# EAGLE schematic Esquemático 01 (EAGLE 9.6.2)
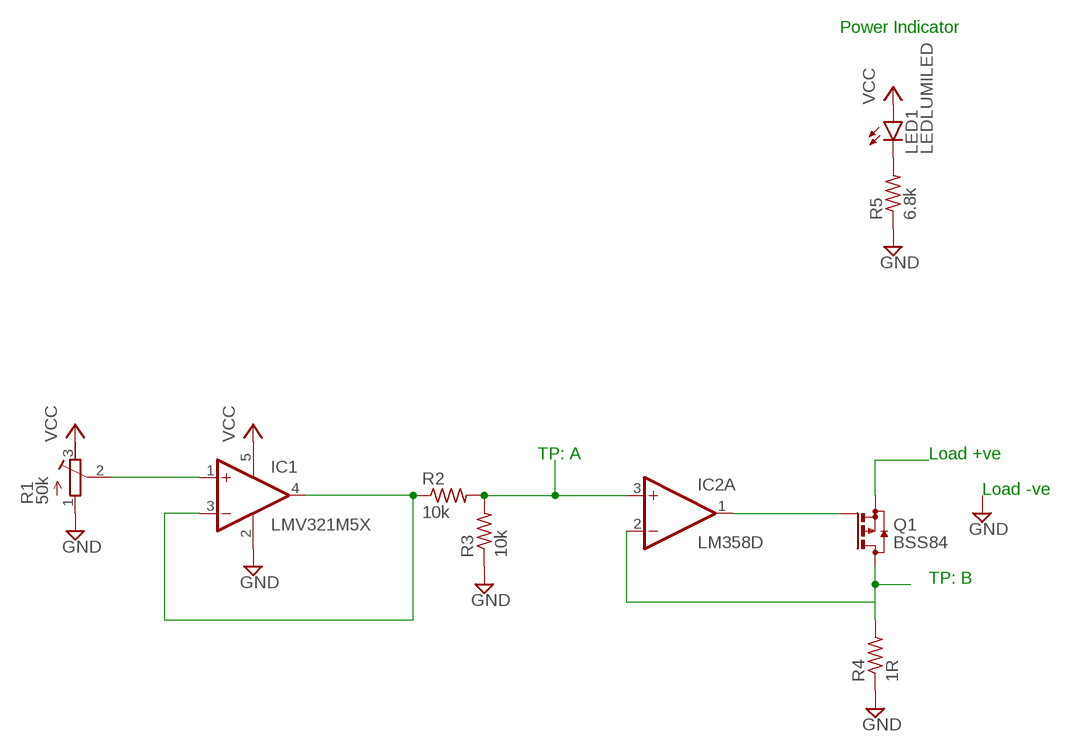
[diagram p0: schematic, sheet 1]

## Parts
IC1  LMV321M5X  [SOT23-5]
IC2  LM358D  [SO08]
LED1  LEDLUMILED  [LUMILED]
Q1  BSS84  [SOT23]
R1  50k  R-TRIMM3339P  [RTRIM3339P]
R2  10k  R-US_0207/10  [0207/10]
R3  10k  R-US_0207/10  [0207/10]
R4  1R  R-US_0207/10  [0207/10]
R5  6.8k  R-US_0207/10  [0207/10]

## Nets
GND: IC1.2(V-) R1.1(A) R3.1 R4.1 R5.1
N$1: IC1.3(-IN) IC1.4(OUT) R2.1
N$2: IC1.1(+IN) R1.2(S)
N$3: IC2.3(A:+IN) R2.2 R3.2
N$4: IC2.2(A:-IN)
N$5: IC2.1(A:OUT) Q1.1(G)
N$6: Q1.3(D) R4.2
N$7: LED1.4-(C) R5.2
N$8: Q1.2(S)
VCC: IC1.5(V+) LED1.2+(A) R1.3(E)
Unconnected: IC2.5(B:+IN) IC2.6(B:-IN) IC2.7(B:OUT)

## Notes on the sheet
- Power Indicator
- TP: A | Load +ve
- Load -ve
- TP: B

## Power pins joined to a net without a drawn wire
V+: IC2.8(P:V+)
V-: IC2.4(P:V-)

## Library data of the parts
IC1 = linear:LMV321?*: General Purpose, Low Voltage, Rail-to-Rail Output Operational Amplifiers Source: http://www.national.com/mpf/LM/LMV321.html http://www.national.com/dt/lmv_qual.pdf
IC2 = linear:LM358: OP AMP also LM158; LM258; LM2904 Source: http://cache.national.com/ds/LM/LM158.pdf
LED1 = led-lumiled:LED: LED - LUMILED® LXK2-PW12-R00, LXK2-PW12-S00, LXK2-PW14-U00, LXK2-PW14-V00 LXK2-PM12-R00, LXK2-PM12-S00, LXK2-PM14-U00 LXK2-PE12-Q00, LXK2-PE12-R00, LXK2-PE12-S00, LXK2-PE14-T00, LXK2-PE14-U00 LXK2-PB12-K00, LXK2-PB12-L00, LXK2-PB12-M00, LXK2-PB14-N00, LXK2-PB14-P00, LXK2-PB14-Q00 LXK2-PR12-L00, LXK2-PR12-M00, LXK2-PR14-Q00, LXK2-PR14-R00 LXK2-PD12-Q00, LXK2-PD12-R00, LXK2-PD12-S00 LXK2-PH12-R00, LXK2-PH12-S00 LXK2-PL12-P00, LXK2-PL12-Q00, LXK2-PL12-R00 Source: www.luxeon.com; OC_FARNELL: unknown; OC_NEWARK: unknown
Q1 = transistor-small-signal:BSS84: P-CHANNEL MOS FET
R1 = rcl:R-TRIMM: Trimm resistor; SPICEMODEL: X; SPICEPREFIXL: POT
R2-R5 = rcl:R-US_: RESISTOR, American symbol; SPICEPREFIX: R